# EAGLE design Antenna Board v2 (EAGLE 9.6.2)
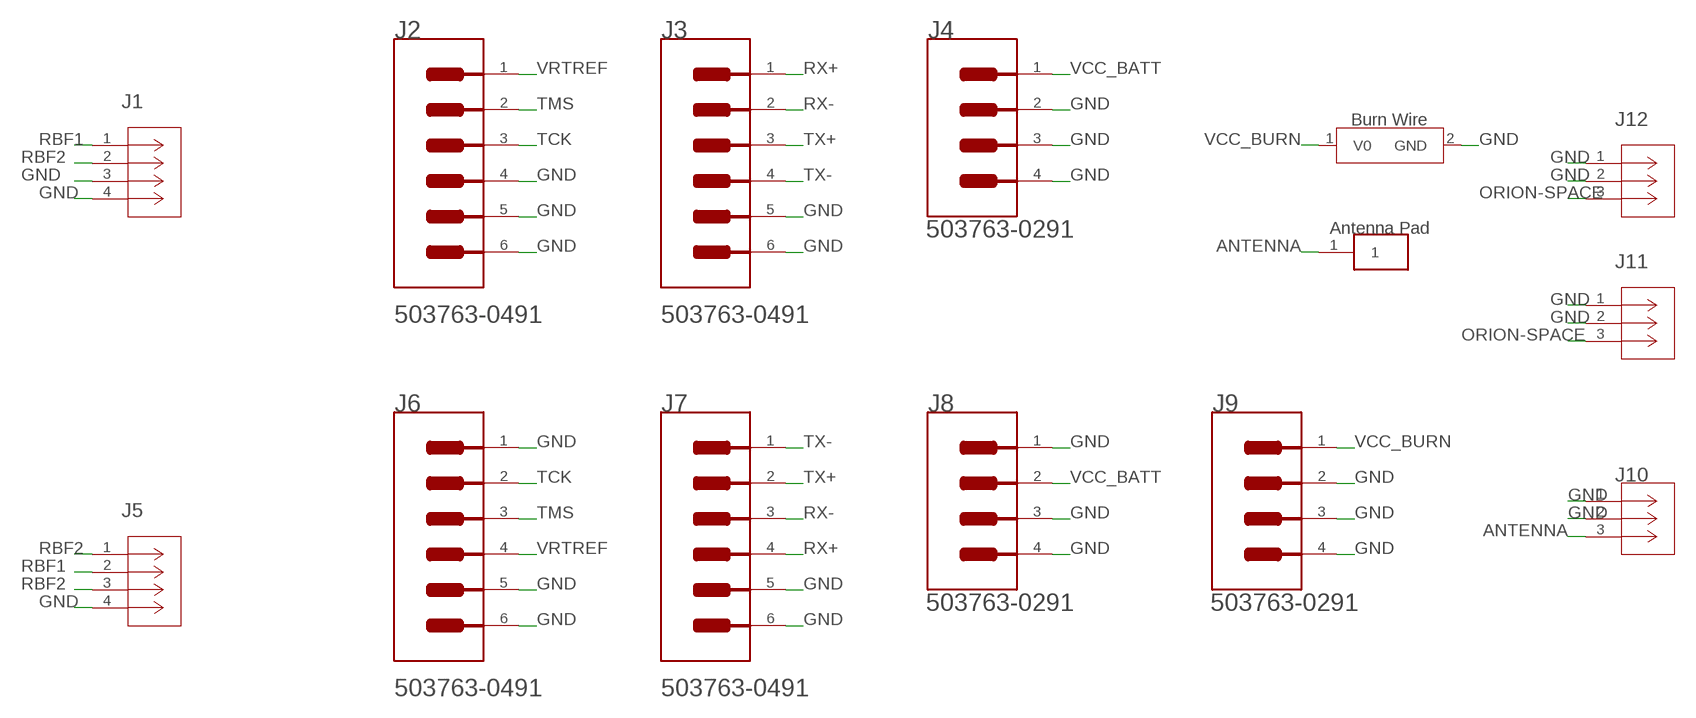
[diagram p0: schematic, sheet 1]

## Parts
J1  5037630291  [CON_5037630291]
J2  MOLEX_503763-0491MOLEX_503763-0491_0_0  [MOLEX_503763-0491_0]
J3  MOLEX_503763-0491MOLEX_503763-0491_0_0  [MOLEX_503763-0491_0]
J4  MOLEX_503763-0291MOLEX_503763-0291_0_0  [MOLEX_503763-0291_0]
J5  5037630291  [CON_5037630291]
J6  MOLEX_503763-0491MOLEX_503763-0491_0_0  [MOLEX_503763-0491_0]
J7  MOLEX_503763-0491MOLEX_503763-0491_0_0  [MOLEX_503763-0491_0]
J8  MOLEX_503763-0291MOLEX_503763-0291_0_0  [MOLEX_503763-0291_0]
J9  MOLEX_503763-0291MOLEX_503763-0291_0_0  [MOLEX_503763-0291_0]
J10  U.FL-R-SMT-1(01)  [CONN_-SMT-1(01)]
J11  U.FL-R-SMT-1(01)  [CONN_-SMT-1(01)]
J12  U.FL-R-SMT-1(01)  [CONN_-SMT-1(01)]
U$2  ANTENNA_PAD  [ANTENNA_PAD]
U$3  BURNWIRE  [BURNWIRE]

## Nets
ANTENNA: J10.3 U$2.1
GND: J1.3 J1.4 J2.4 J2.5(MNT_1) J2.6(MNT_2) J3.5(MNT_1) J3.6(MNT_2) J4.2 J4.3(MNT_1) J4.4(MNT_2) J5.4 J6.1 J6.5(MNT_1) J6.6(MNT_2) J7.5(MNT_1) J7.6(MNT_2) J8.1 J8.3(MNT_1) J8.4(MNT_2) J9.2 J9.3(MNT_1) J9.4(MNT_2) J10.1 J10.2 J11.1 J11.2 J12.1 J12.2 U$3.2(GND)
ORION-SPACE: J11.3 J12.3
RBF1: J1.1 J5.2
RBF2: J1.2 J5.1 J5.3
RX+: J3.1 J7.4
RX-: J3.2 J7.3
TCK: J2.3 J6.2
TMS: J2.2 J6.3
TX+: J3.3 J7.2
TX-: J3.4 J7.1
VCC_BATT: J4.1 J8.2
VCC_BURN: J9.1 U$3.1(V0)
VRTREF: J2.1 J6.4

## Library data of the parts
J1 J5 = Molex_503763-0291:5037630291; BUILT_BY: Molex_Team; COPYRIGHT: Copyright (C) 2018 Accelerated Designs. All rights reserved; MANUFACTURER_PART_NUMBER: 5037630291; SOURCELIBRARY: Add_to_database_2021-03-17; VENDOR: Molex Connector Corporation
J2 J3 J6 J7 = Molex - 503763-0491:MOLEX_503763-0491: Wire-To-Board Connector, Pico-Lock 503763 Series, Surface Mount, Header, 4 Contacts, 1 mm; AUTOMOTIVE: No; CENTROID_NOT_SPECIFIED: No; CONN_GENDER: Male; CONN_ORIENTATION: Right Angle; CONTACT_MATERIAL: Gold,Nickel; CURRENT_RATING: 1.5A; DATASHEET: https://www.molex.com/webdocs/datasheets/pdf/en-us/5037630491_PCB_HEADERS.pdf; DEVICE_CLASS_L1: Connectors; DEVICE_CLASS_L2: Headers and Wire Housings; DEVICE_CLASS_L3: unset; DIGIKEY_DESCRIPTION: CONN HEADER 1MM R/A 4CKT; DIGIKEY_PART_NUMBER: WM10655CT-ND; FOOTPRINT_URL: https://www.molex.com/pdm_docs/sd/5037630491_sd.pdf; FOOTPRINT_VARIANT_NAME_0: Recommended_Land_Pattern; HEIGHT: 1.7mm; LEAD_FREE: Yes; MF: Molex; MFG_PACKAGE_IDENT: 503763-0491; MFG_PACKAGE_IDENT_DATE: 0; MFG_PACKAGE_IDENT_REV: 0; MOUSER_PART_NUMBER: 538-503763-0491; MPN: 503763-0491; NUMBER_OF_CONTACTS: 4; NUMBER_OF_ROWS: 1; PACKAGE: HDR4; PITCH: 1mm; PREFIX: J; ROHS: Yes; TEMPERATURE_RANGE_HIGH: +105°C; TEMPERATURE_RANGE_LOW: -40°C; VERIFICATION_VERSION: 0.0.0.1; VOLTAGE_RATING: 150V
J4 J8 J9 = Molex - 503763-0291:MOLEX_503763-0291: 2 Positions Header Connector 0.039" (1.00mm) Surface Mount, Right Angle Gold; CENTROID_NOT_SPECIFIED: No; DATASHEET: http://www.molex.com/pdm_docs/sd/5037630291_sd.pdf; DIGIKEY_DESCRIPTION: CONN HEADER 1MM R/A 2CKT; DIGIKEY_PART_NUMBER: WM10654CT-ND; LEAD_FREE: yes; MF: Molex; MOUSER_PART_NUMBER: 538-503763-0291; MPN: 503763-0291; PACKAGE: HDR02; PREFIX: J; ROHS: yes; TEMPERATURE_RANGE_HIGH: +105°C; TEMPERATURE_RANGE_LOW: -40°C
J10 = U.FL-R-SMT-1(01):U.FL-R-SMT-1(01); BUILT_BY: EMA_Matt; COPYRIGHT: Copyright (C) 2018 Accelerated Designs. All rights reserved; MANUFACTURER_PART_NUMBER: U.FL-R-SMT-1(01); SOURCELIBRARY: Hirose_12_20_2019; VENDOR: Hirose
J11 J12 = U.FL-R-SMT:U.FL-R-SMT-1(01); BUILT_BY: EMA_Matt; COPYRIGHT: Copyright (C) 2018 Accelerated Designs. All rights reserved; MANUFACTURER_PART_NUMBER: U.FL-R-SMT-1(01); SOURCELIBRARY: Hirose_12_20_2019; VENDOR: Hirose
U$2 = Antenna_Pad:ANTENNA_PAD
U$3 = Burn_Wire:BURNWIRE

## Board
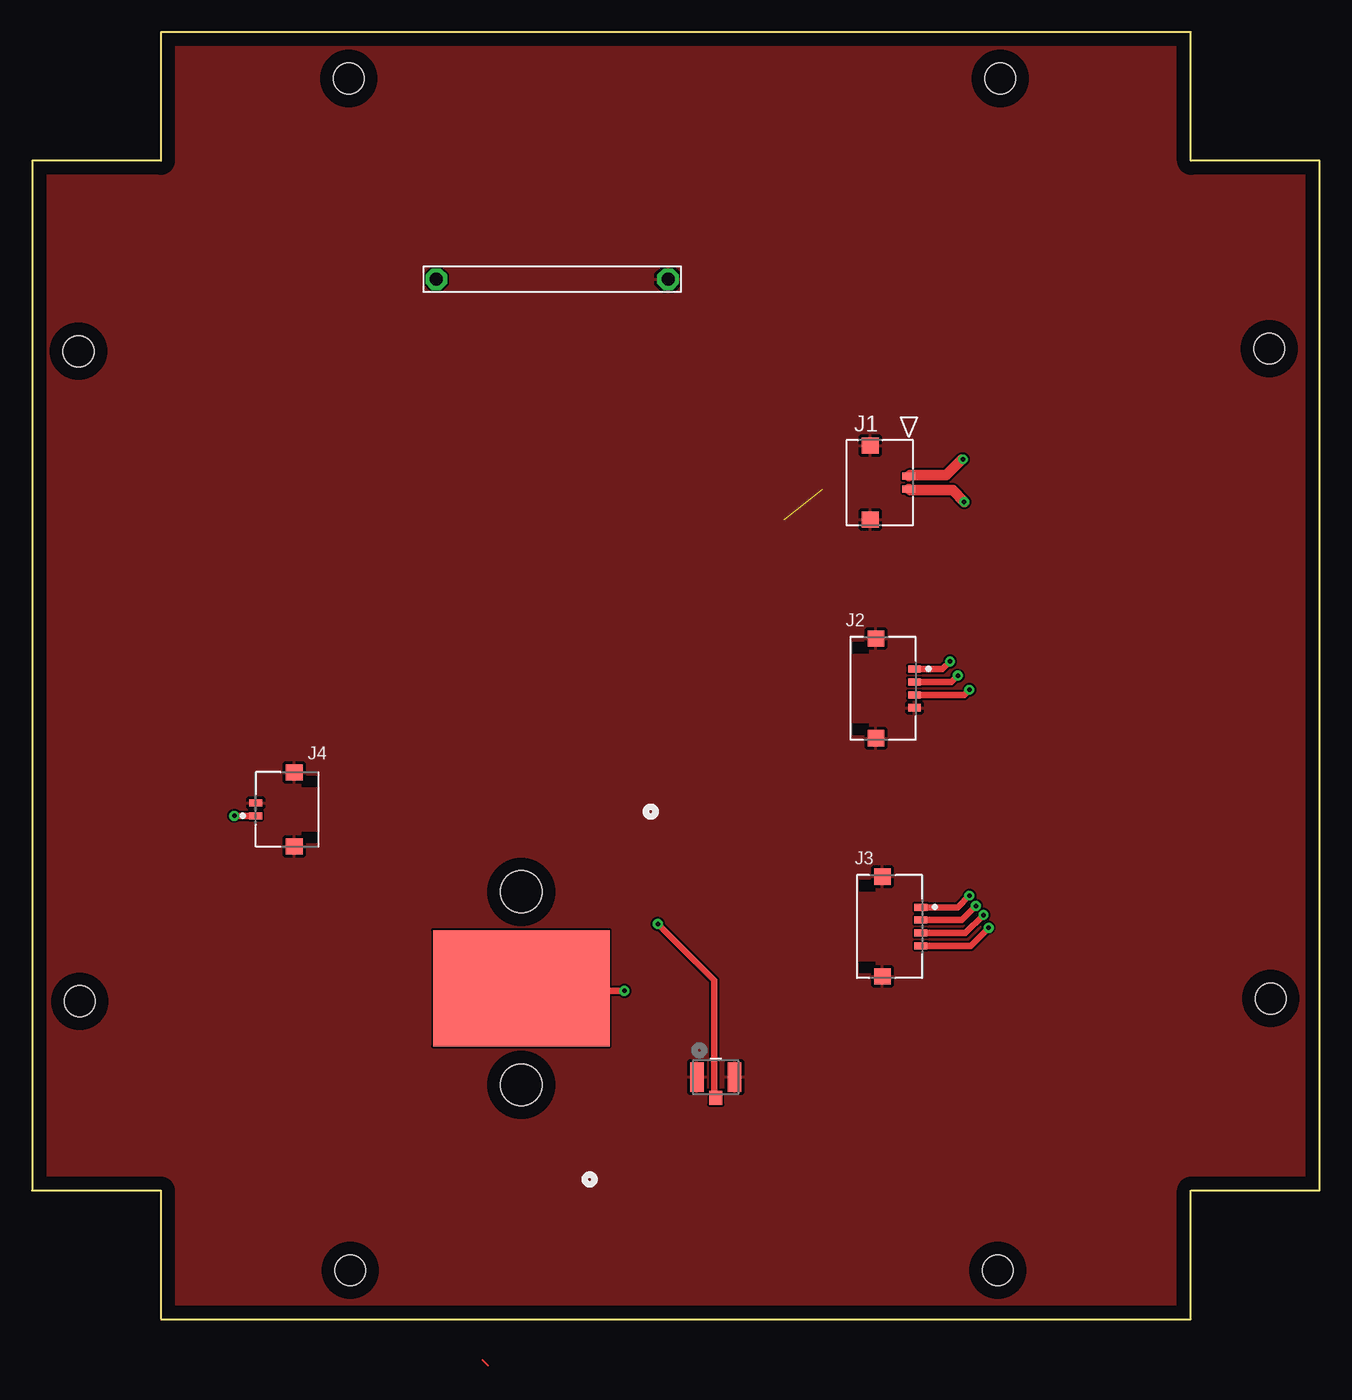
[diagram p1: board, top side]
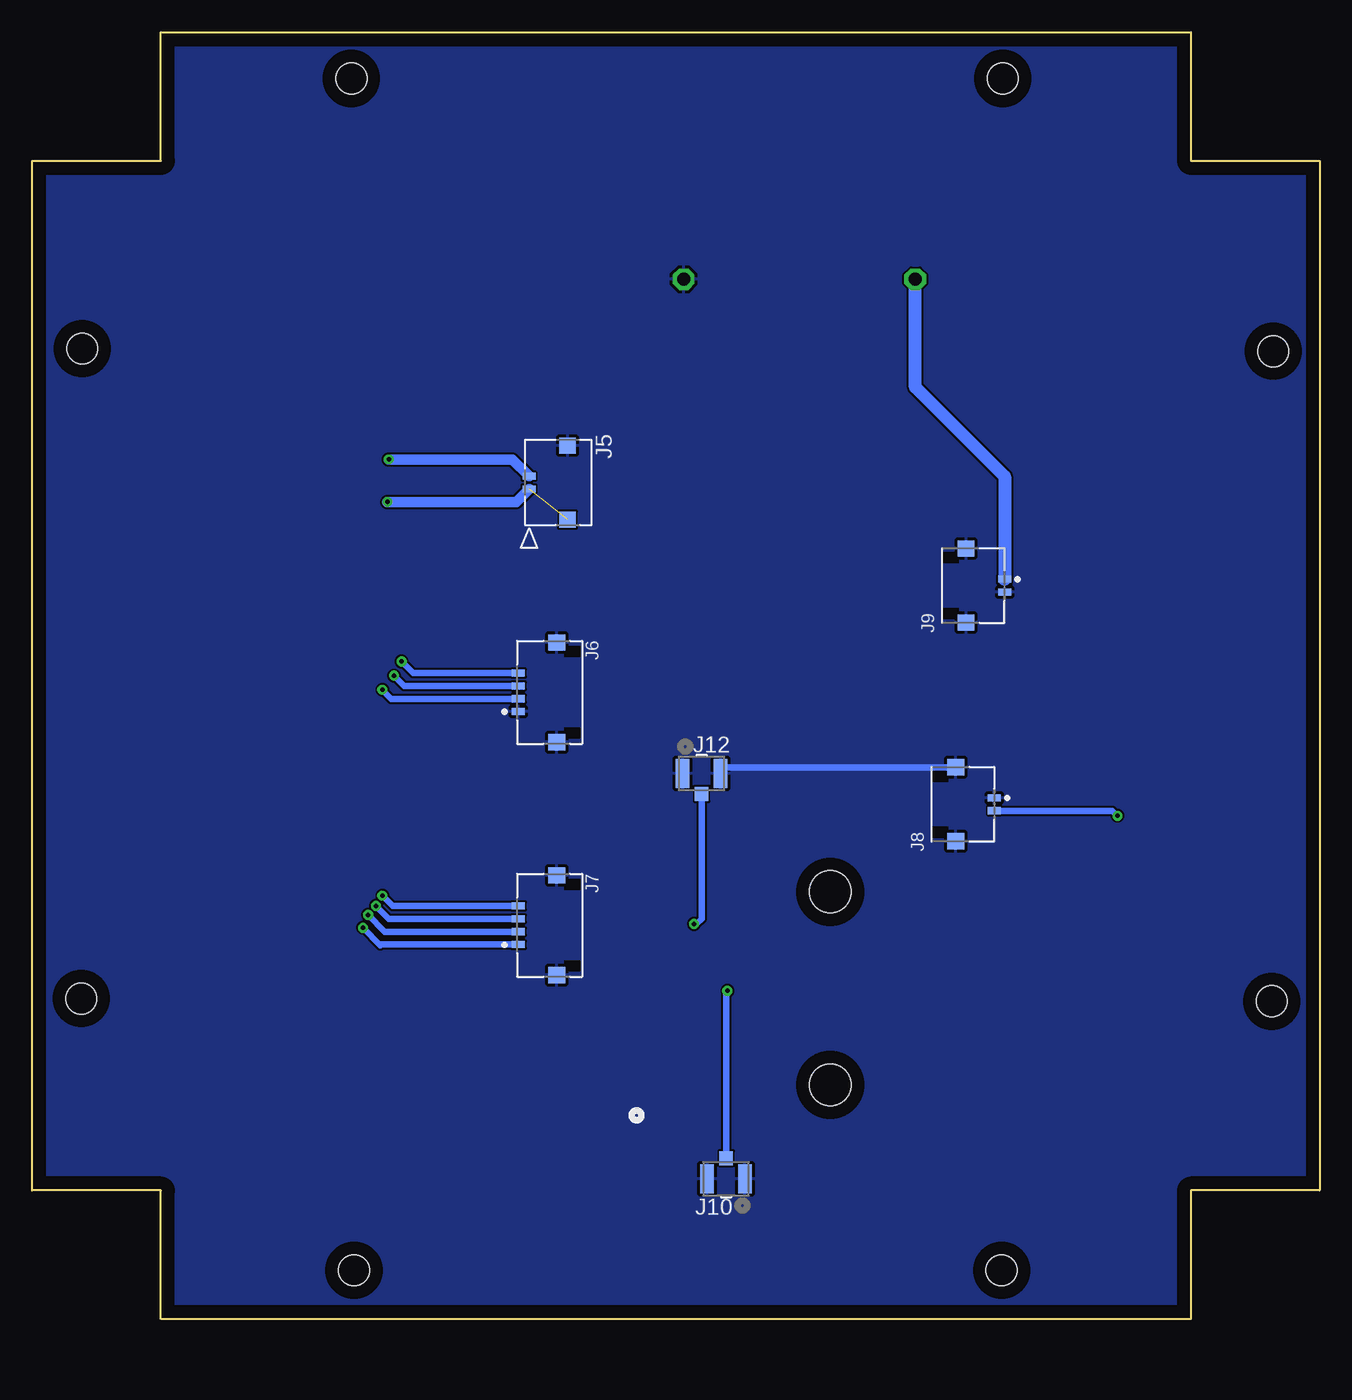
[diagram p2: board, bottom side, seen from below]

Size 100 x 100 mm. Coordinates in mm from the lower left corner, seen from the top.
Outline: 0,10 10,10 10,0 90,0 90,10 100,10 100,90 90,90 90,100 10,100 10,90 0,90 0,10
Copper layers (1*16): Top 0.035mm / dielectric 1.5mm / Bottom 0.035mm
Design rules "default": minimum track width 6mil, minimum drill 0.35mm, track to track 6mil, track to pad 6mil, pad to pad 6mil, via to via 6mil, smd to smd 6mil, copper to edge 40mil, drill to drill 6mil, minimum pad ring 10mil, minimum via ring 8mil, stop-mask expansion 4mil, vias tented up to drill 0mil, thermal gap 10mil
Holes 3.26 mm at 38,18.2 38,33.2
Holes 2.4 mm at 3.7,24.7 24.7,3.8 75,3.8 96.2,24.9 96.1,75.4 75.2,96.4 24.6,96.4 3.6,75.2

### Footprints (pad centres in the part's own frame; a part is rotated, then mirrored left to right if it is on the bottom)
CON_5037630291 = smd 0.55 x 1: 1 0,0; 2 -1,0 | smd 1.26 x 1.3: 3 2.375,2.99; 4 -3.38,2.99
MOLEX_503763-0491_0 = smd 0.55 x 1: 1 1.5,-2.435; 2 0.5,-2.435; 3 -0.5,-2.435; 4 -1.5,-2.435 | smd 1.26 x 1.3: 5 -3.875,0.555; 6 3.875,0.555
MOLEX_503763-0291_0 = smd 0.55 x 1: 1 0.5,-2.435; 2 -0.5,-2.435 | smd 1.26 x 1.3: 3 -2.875,0.555; 4 2.875,0.555
CONN_-SMT-1(01) = smd 1.041 x 2.261: 1 -1.47,0; 2 1.47,0 | smd 1.041 x 1.092: 3 0,-1.596
ANTENNA_PAD = smd 13.7 x 9: 1 0,0
BURNWIRE = drill 1 pad 1.676 octagon: 1 -9,0; 2 9,0

### Placement (x,y rotation side)
J1  68.1,65.5 90 top
J2  66.1,49 90 top
J3  66.6,30.5 90 top
J4  19.8,39.6 270 top
J5  61.4,64.5 270 bottom
J6  59.8,48.7 270 bottom
J7  59.8,30.6 270 bottom
J8  27.7,40 90 bottom
J9  26.9,57 90 bottom
J10  46.1,10.9 180 bottom
J11  53.1,18.8 0 top
J12  48,42.4 0 bottom
U$2  38,25.7 0 top
U$3  40.4,80.8 0 top

### Tracks (layer width: path | path; a pad name or v marks a point on that pad's centre or on a via)
ANTENNA  (via drill 0.35)
  Top 0.508: v46,25.5 38.2,25.5 U$2.1
  Bottom 0.508: v46,25.5 46.1,25.4 J10.3
GND
  Top 0.152: J11.1 51.73,18.9
  Bottom 0.152: J12.2 46.38,42.25
  Bottom 0.508: J8.4 46.05,42.88 J12.2
  pour Top: -1,101 101,101 101,-1 -1,-1
  pour Bottom: -2,102 102,102 102,-2 -2,-2
N$1
  Top 0.152: 35,-3.2 35.4,-3.6
ORION-SPACE  (via drill 0.35)
  Top 0.508: J11.3 53,17.3 53,26.3 v48.6,30.7
  Bottom 0.508: v48.6,30.7 48.4,30.7 48,31.1 J12.3
RBF1  (via drill 0.35)
  Top 0.152: v72.3,66.8 72.2,66.8
  Top 0.813: 72.2,66.8 71,65.6 68.2,65.6 J1.1
  Bottom 0.813: J5.2 62.7,66.8 v72.3,66.8
RBF2  (via drill 0.35)  (1 unrouted)
  Top 0.813: v72.4,63.5 71.5,64.4 68.2,64.4 J1.2
  Bottom 0.813: v72.4,63.5 62.4,63.5 J5.1
RX+  (via drill 0.35)
  Top 0.508: v72.8,32.9 71.9,32 J3.1
  Bottom 0.508: v72.8,32.9 72,32.1 J7.4
RX-  (via drill 0.35)
  Top 0.508: J3.2 72.2,31 v73.3,32.1
  Bottom 0.508: v73.3,32.1 72.3,31.1 J7.3
TCK  (via drill 0.35)
  Top 0.508: v72.8,48.9 72.4,48.5 J2.3
  Bottom 0.508: v72.8,48.9 72.1,48.2 J6.2
TMS  (via drill 0.35)
  Top 0.508: v71.9,50 71.4,49.5 J2.2
  Bottom 0.508: v71.9,50 71.1,49.2 J6.3
TX+  (via drill 0.35)
  Top 0.508: J3.3 72.5,30 v73.9,31.4
  Bottom 0.508: v73.9,31.4 72.6,30.1 J7.2
TX-  (via drill 0.35)
  Top 0.508: J3.4 72.9,29 v74.3,30.4
  Bottom 0.508: v74.3,30.4 72.95,29.05 72.9,29.1 J7.1
VCC_BATT  (via drill 0.35)
  Top 0.508: J4.1 v15.7,39.1
  Bottom 0.508: v15.7,39.1 16.1,39.5 J8.2
VCC_BURN
  Bottom 1.016: J9.1 24.46,65.48 31.4,72.42 U$3.1
VRTREF  (via drill 0.35)
  Top 0.508: v71.3,51.1 70.7,50.5 J2.1
  Bottom 0.508: v71.3,51.1 70.4,50.2 J6.4